# Altium schematic sheet Sheet1.SchDoc
size A
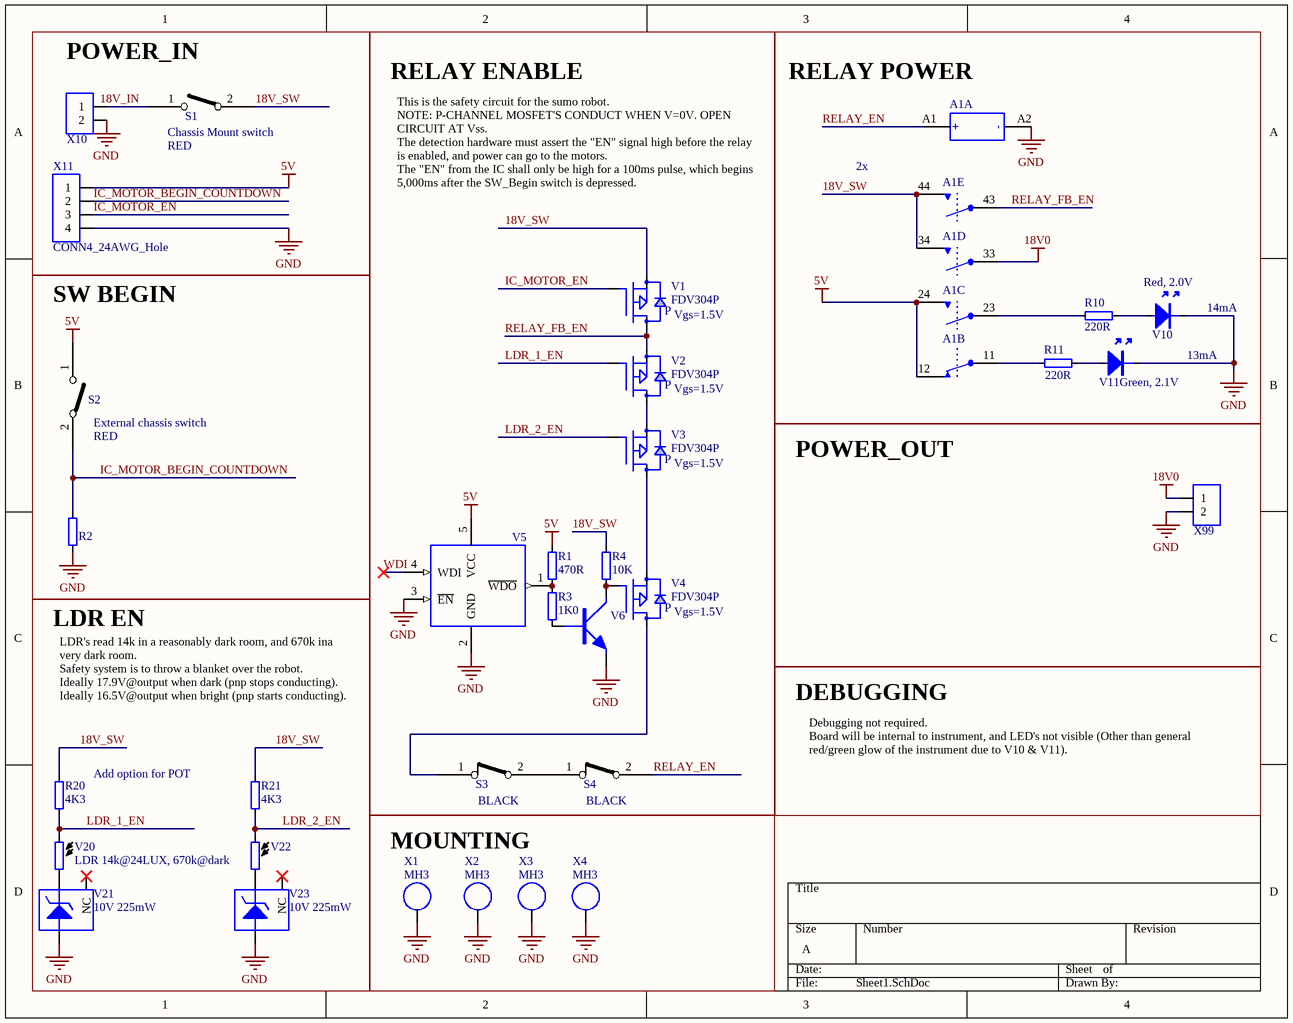
[diagram p0: Sheet1.SchDoc]

## Parts
A1  RELAY SAFETY 4PST 8A 18V  [RELAY-BRUMFIELD-4PST-3NO-1NC]  (value not drawn)  (parts A,B,C,D,E of 5)
R1  470R  [1206]
R2  10K  [1206]  (value not drawn)
R3  1K0  [1206]
R4  10K  [1206]
R10  220R  [1206]
R11  220R  [1206]
R20  4K3  [0603]
R21  4K3  [0603]
S1  SWITCH Rocker SPST Panel Mount, Red  [2_Wire_12AWG]  (value not drawn)
S2  Switch NO  [2_Wire_12AWG]  (value not drawn)
S3  Switch NC  [2_Wire_20AWG]  (value not drawn)
S4  Switch NC  [2_Wire_20AWG]  (value not drawn)
V1  FDV304P  [SOT23]
V2  FDV304P  [SOT23]
V3  FDV304P  [SOT23]
V4  FDV304P  [SOT23]
V5  STWD100NYWY3F  [SOT23-5]  (value not drawn)
V6  BC846B  [SOT23]  (value not drawn)
V10  Red, 2.0V  [LED-0805]
V11  Green, 2.1V  [LED-0805]
V20  LDR 14k@24LUX, 670k@dark  [LDR_NSL-5112]
V21  10V 225mW  [SOT23]
V22  LDR 14k@24LUX, 670k@dark  [LDR_NSL-5112]  (value not drawn)
V23  10V 225mW  [SOT23]
X1  MH3  [MH-M3-SEMS-6.7-3.6-Vias-Unplated]  (no BOM)
X2  MH3  [MH-M3-SEMS-6.7-3.6-Vias-Unplated]  (no BOM)
X3  MH3  [MH-M3-SEMS-6.7-3.6-Vias-Unplated]  (no BOM)
X4  MH3  [MH-M3-SEMS-6.7-3.6-Vias-Unplated]  (no BOM)
X10  CONN2_12AWG_Hole  [2_Wire_12AWG]  (value not drawn)  (no BOM)
X11  CONN4_24AWG_Hole  [4_Wire_0.1"]  (no BOM)
X99  CONN2_12AWG_Hole  [2_Wire_12AWG]  (value not drawn)  (no BOM)

## Blocks framed on the sheet
POWER_IN: S1 X10 X11
RELAY ENABLE: R1 R3 R4 S3 S4 V1-V6
RELAY POWER: A1 R10 R11 V10 V11
SW BEGIN: R2 S2
POWER_OUT: X99
LDR EN: R20 R21 V20-V23
MOUNTING: X1-X4

## Nets
5V: A1.12 A1.24 R1.1 S2.1 V5.5(VCC) X11.1
18V0: A1.33 X99.1
GND: A1.A2 R2.1 V5.2(GND) V5.3(~{EN}) V6.y(Emitter) V10.k V11.k V21.z(a) V23.z(a) X1.1 X2.1 X3.1 X4.1 X10.2 X11.4 X99.2
18V_SW: A1.34 A1.44 R4.2 R20.2 R21.2 S1.2 V1.y(s)
IC_MOTOR_BEGIN_COUNTDOWN: R2.2 S2.2 X11.2
IC_MOTOR_EN: V1.z(gate) X11.3
LDR_1_EN: R20.1 V2.z(gate) V20.1
LDR_2_EN: R21.1 V3.z(gate) V22.1
RELAY_EN: A1.A1 S4.2
RELAY_FB_EN: A1.43 V1.x(d) V2.y(s)
WDI: V5.4(WDI)
NetA1_11: A1.11 R11.1
NetA1_23: A1.23 R10.1
NetR1_2: R1.2 R3.2 V5.1(~{WDO})
NetR3_1: R3.1 V6.z(Base)
NetR4_1: R4.1 V4.z(gate) V6.x(Collector)
NetR10_2: R10.2 V10.a
NetR11_2: R11.2 V11.a
NetS1_1: S1.1 X10.1
NetS3_1: S3.1 V4.x(d)
NetS3_2: S3.2 S4.1
NetV2_x: V2.x(d) V3.y(s)
NetV3_x: V3.x(d) V4.y(s)
NetV20_2: V20.2 V21.x(k)
NetV22_2: V22.2 V23.x(k)

Not connected (* = marked no-connect by the designer): V21 y(NC)*; V23 y(NC)*

## Notes on the sheet
- (near S1) Chassis Mount switch
- (near S1) RED
- This is the safety circuit for the sumo robot.
  NOTE: P-CHANNEL MOSFET'S CONDUCT WHEN V=0V. OPEN CIRCUIT AT Vss.
  The detection hardware must assert the "EN" signal high before the relay is enabled, and power can go to the motors.
  The "EN" from the IC shall only be high for a 100ms pulse, which begins 5,000ms after the SW_Begin switch is depressed.
- 2x
- (near V1) Vgs=1.5V
- 13mA
- (near V10) 14mA
- (near S2) External chassis switch
- (near V2) Vgs=1.5V
- (near S2) RED
- (near V3) Vgs=1.5V
- (near V4) Vgs=1.5V
- DEBUGGING
- LDR's read 14k in a reasonably dark room, and 670k ina  very dark room.
  Safety system is to throw a blanket over the robot.
  Ideally 17.9V@output when dark (pnp stops conducting).
  Ideally 16.5V@output when bright (pnp starts conducting).
- Add option for POT
- (near S3) BLACK
- (near S4) BLACK
- Debugging not required.
  Board will be internal to instrument, and LED's not visible (Other than general red/green glow of the instrument due to V10 & V11).
- Labels drawn without touching a wire or pin: 18V_IN
- (in symbol 5221) P
- (in symbol 9827, part A) -; +

## Library data of the parts
A1 = 9827: Safety Relay 4PST, 3NO 1 NC; Manufacturer: TE Connectivity Potter & Brumfield Relays; PartNumber: SR4M4018; IPN: 9827; Characteristics: 18VDC 405ohm  1250VAC/8A-Switching-load; Lead_Process_Compatible: Yes; SubmittedBy: zmze; DeviceRank: 2; Part Field 1: RELAY SAFETY 4PST 8A 18V; Part Field 2: TE Connectivity Potter & Brumfield Relays SR4M4018; ComponentLink2Description: Compliant; Altium_Comment_Old: RELAY SAFETY 4PST 8A 18V; Altium_Comment: RELAY SAFETY 4PST 8A 18V; Symbol: RELAY-4PST-3A1B; LastChanged: 27/05/16 08:10:39; Supplier1: Digikey; Supplier1_PartNumber: PB1304-ND; IPN_Search: 9827; OrderNumber: SR4M4018; PartType: PCB; ComponentLink1Description: TE Connectivity Potter & Brumfield Relays_SR4M4018_ENG_DS_SR4_DXM_0415.pdf; ComponentLink1URL: http://ecad.vsl.com.au/apps/BomGen/Data/rel/datasheets/TE Connectivity Potter & Brumfield Relays/TE Connectivity Potter & Brumfield Relays_SR4M4018_ENG_DS_SR4_DXM_0415.pdf
R1 = 3835: Resistor; Part Field 1: RES 470R 1% 250mW 1206 RoHS; Manufacturer: Phycomp; PartNumber: RC1206FR-07470RL; IPN: 3835; EndOfLife: Active EOL:Jan 2023; Characteristics: 100ppm/C -55..+155C U=150Vrms Reel=5000pcs; OrderNumber: 232272464701L; Lead_Process_Compatible: Yes; SubmittedBy: ART; DeviceRank: 2; Part Field 2: Phycomp RC1206FR-07470RL; ComponentLink1Description: Phycomp_RC1206series_DS.pdf; ComponentLink2Description: Phycomp_Generic_RCS.pdf; ComponentLink1URL: http://ecad.vsl.com.au/apps/BomGen/Data/rel/datasheets/new_parts/Phycomp_RC1206series_DS.pdf; ComponentLink2URL: http://ecad.vsl.com.au/apps/BomGen/Data/rel/rohs_compliance/new_certificates/Phycomp_Generic_RCS.pdf; Altium_Comment_Old: RES 470R 1% 250mW 1206 RoHS; Altium_Comment: 470R; Symbol: RES; Supplier1: Arrow; Supplier1_PartNumber: RC1206FR-07470RL; Supplier2: Xon; IPN_Search: 3835; PartType: PCB; CheckedBy: ART; Price_5000: M$0.004
R2 R4 = 3867: Resistor; Part Field 1: RES 10K 1% 250mW 1206 RoHS; Manufacturer: Phycomp; PartNumber: RC1206FR-0710KL; IPN: 3867; EndOfLife: Active EOL:Jan 2031; Characteristics: 100ppm/C -55..+155C U=150Vrms Reel=5000pcs; OrderNumber: 232272461003L; Lead_Process_Compatible: Yes; SubmittedBy: ART; DeviceRank: 2; Part Field 2: Phycomp RC1206FR-0710KL; ComponentLink1Description: Phycomp_RC1206series_DS.pdf; ComponentLink2Description: Phycomp_Generic_RCS.pdf; ComponentLink1URL: http://ecad.vsl.com.au/apps/BomGen/Data/rel/datasheets/new_parts/Phycomp_RC1206series_DS.pdf; ComponentLink2URL: http://ecad.vsl.com.au/apps/BomGen/Data/rel/rohs_compliance/new_certificates/Phycomp_Generic_RCS.pdf; Altium_Comment_Old: RES 10K 1% 250mW 1206 RoHS; Altium_Comment: 10K; Symbol: RES; Supplier1: Arrow; Supplier1_PartNumber: RC1206FR-0710KL; Supplier2: Xon; IPN_Search: 3867; PartType: PCB; CheckedBy: ART; Price_5000: M$0.004
R3 = 3843: Resistor; Part Field 1: RES 1K0 1% 250mW 1206 RoHS; Manufacturer: Phycomp; PartNumber: RC1206FR-071KL; IPN: 3843; EndOfLife: Active EOL:Jan 2031; Characteristics: 100ppm/C -55..+155C U=150Vrms Reel=5000pcs; OrderNumber: 232272461002L; Lead_Process_Compatible: Yes; SubmittedBy: ART; DeviceRank: 2; Part Field 2: Phycomp RC1206FR-071KL; ComponentLink1Description: Phycomp_RC1206series_DS.pdf; ComponentLink2Description: Phycomp_Generic_RCS.pdf; ComponentLink1URL: http://ecad.vsl.com.au/apps/BomGen/Data/rel/datasheets/new_parts/Phycomp_RC1206series_DS.pdf; ComponentLink2URL: http://ecad.vsl.com.au/apps/BomGen/Data/rel/rohs_compliance/new_certificates/Phycomp_Generic_RCS.pdf; Altium_Comment_Old: RES 1K0 1% 250mW 1206 RoHS; Altium_Comment: 1K0; Symbol: RES; Supplier1: Arrow; Supplier1_PartNumber: RC1206FR-071KL; Supplier2: Xon; IPN_Search: 3843; PartType: PCB; CheckedBy: ART; Price_5000: M$0.004
R10 R11 = 3827: Resistor; Part Field 1: RES 220R 1% 250mW 1206 RoHS; Manufacturer: Phycomp; PartNumber: RC1206FR-07220RL; IPN: 3827; EndOfLife: Active EOL:Jan 2023; Characteristics: 100ppm/C -55..+155C U=150Vrms Reel=5000pcs; OrderNumber: 232272462201L; Lead_Process_Compatible: Yes; SubmittedBy: ART; DeviceRank: 2; Part Field 2: Phycomp RC1206FR-07220RL; ComponentLink1Description: Phycomp_RC1206series_DS.pdf; ComponentLink2Description: Phycomp_Generic_RCS.pdf; ComponentLink1URL: http://ecad.vsl.com.au/apps/BomGen/Data/rel/datasheets/new_parts/Phycomp_RC1206series_DS.pdf; ComponentLink2URL: http://ecad.vsl.com.au/apps/BomGen/Data/rel/rohs_compliance/new_certificates/Phycomp_Generic_RCS.pdf; Altium_Comment_Old: RES 220R 1% 250mW 1206 RoHS; Altium_Comment: 220R; Symbol: RES; Supplier1: Arrow; Supplier1_PartNumber: RC1206FR-07220RL; Supplier2: Xon; IPN_Search: 3827; PartType: PCB; CheckedBy: ART; Price_5000: M$0.004
R20 R21 = 3520: Resistor; Part Field 1: RES 4K3 1% 100mW 0603 RoHS; Manufacturer: Phycomp; PartNumber: RC0603FR-074K3L; IPN: 3520; EndOfLife: Active EOL:Jan 2023; AltIPN1: 6663; AltMFG1: PANASONIC; AltPN1: ERJ3EKF4301V; Characteristics: 100ppm/C -55..+155C U=50Vrms Reel=5000pcs; OrderNumber: 232270464302L; Lead_Process_Compatible: Yes; SubmittedBy: ART; DeviceRank: 1; Part Field 2: Phycomp RC0603FR-074K3L; ComponentLink1Description: Phycomp_RC0603series_DS.pdf; ComponentLink2Description: Phycomp_Generic_RCS.pdf; ComponentLink1URL: http://ecad.vsl.com.au/apps/BomGen/Data/rel/datasheets/new_parts/Phycomp_RC0603series_DS.pdf; ComponentLink2URL: http://ecad.vsl.com.au/apps/BomGen/Data/rel/rohs_compliance/new_certificates/Phycomp_Generic_RCS.pdf; Altium_Comment_Old: RES 4K3 1% 100mW 0603 RoHS; Altium_Comment: 4K3; Symbol: RES; LastChanged: 28/11/07 14:44:00; AltDesc1: RES 4K3 1% 100mW 0603 RoHS; AltROHS1: pa003.pdf; AltEOL1: Active EOL:Jan 2023; Supplier1: Arrow; Supplier1_PartNumber: RC0603FR-074K3L; Supplier2: Xon; Supplier2_PartNumber: 232270464302L; IPN_Search: 3520; PartType: PCB; CheckedBy: ART; Price_5000: M$0.002
S1 = 9815: SWITCH; Manufacturer: Cherry; PartNumber: CRE22F2BBRLE; IPN: 9815; Characteristics: V=125Vac, I=20A; Lead_Process_Compatible: Yes; SubmittedBy: presi; DeviceRank: 2; Part Field 1: SWITCH Rocker SPST Panel Mount, Red; Part Field 2: Cherry CRE22F2BBRLE; ComponentLink1Description: -; ComponentLink2Description: Compliant; ComponentLink1URL: -; ComponentLink2URL: -; Altium_Comment_Old: SWITCH Rocker SPST Panel Mount, Red; Altium_Comment: SWITCH Rocker SPST Panel Mount, Red; Symbol: Switch_SPST-NO; LastChanged: 13-06-16 21:14:44; Supplier1: DigiKey; Supplier1_PartNumber: CH809-ND; IPN_Search: 9815; OrderNumber: CRE22F2BBRLE; PartType: PCB
S2 = 9814: SWITCH; Part Field 1: Switch, Panel Mount, Momentary, SPST-NO, 0.5A 125V, RoHS; Manufacturer: TE Connectivity; PartNumber: 1437568-6; IPN: 9814; Characteristics: 0.5A 125V; Lead_Process_Compatible: Yes; SubmittedBy: presi; DeviceRank: 2; Part Field 2: TE Connectivity 1437568-6; ComponentLink1Description: -; ComponentLink2Description: Compliant; ComponentLink1URL: -; ComponentLink2URL: -; Altium_Comment_Old: Switch, Panel Mount, Momentary, SPST-NO, 0.5A 125V, RoHS; Altium_Comment: Switch NO; Symbol: Switch_SPST-NO; LastChanged: 13-06-16 21:00:15; Supplier1: Digi-Key; Supplier1_PartNumber: 450-1110-ND; IPN_Search: 9814; OrderNumber: 1437568-6; PartType: PCB
S3 S4 = 9813: SWITCH; Part Field 1: Switch, Panel Mount, Momentary, SPST-NC, 0.5A 125V, RoHS; Manufacturer: TE Connectivity; PartNumber: MSPS103B; IPN: 9813; Characteristics: 0.5A 125V; Lead_Process_Compatible: Yes; SubmittedBy: presi; DeviceRank: 2; Part Field 2: TE Connectivity MSPS103B; ComponentLink1Description: -; ComponentLink2Description: Compliant; ComponentLink1URL: -; ComponentLink2URL: -; Altium_Comment_Old: Switch, Panel Mount, Momentary, SPST-NC, 0.5A 125V, RoHS; Altium_Comment: Switch NC; Symbol: Switch_SPST-NC; LastChanged: 13-06-16 20:48:49; Supplier1: Digi-Key; Supplier1_PartNumber: 450-1099-ND; IPN_Search: 9813; OrderNumber: MSPS103B; PartType: PCB
V1-V4 = 5221: MOSFET P CHANNEL GENERIC SOT23; Part Field 1: MOSFET P-CH FDV304P SOT23; Manufacturer: Fairchild; IPN: 5221; EndOfLife: Active EOL:Jul 2022; Characteristics: 25V 0.46A 1.5R Vgs=1.5V 150deg; Lead_Process_Compatible: Yes; SubmittedBy: KZB; DeviceRank: 2; Part Field 2: Fairchild FDV304P; ComponentLink1Description: Fairchild_FDV304P_DS.pdf; ComponentLink2Description: Fairchild_Generic_RCS.pdf; ComponentLink1URL: http://ecad.vsl.com.au/apps/BomGen/Data/rel/datasheets/new_parts/Fairchild_FDV304P_DS.pdf; ComponentLink2URL: http://ecad.vsl.com.au/apps/BomGen/Data/rel/rohs_compliance/new_certificates/Fairchild_Generic_RCS.pdf; Altium_Comment_Old: MOSFET P-CH FDV304P SOT23; Altium_Comment: FDV304P; Symbol: MOSFET-P-SOT23; PartNumber: FDV304P; LastChanged: 10/06/10 13:58:43; Supplier1: Digikey; Supplier1_PartNumber: FDV304PCT-ND; Supplier2: Farnell; Supplier2_PartNumber: 9846123; IPN_Search: 5221; OrderNumber: FDV304P; PartType: PCB; Price: 0.697; CheckedBy: AJR; Price_100: M$0.102; Price_1000: M$0.070; Price_5000: M$0.053
V5 = 5674: IC Watchdog Timer Circuit; Part Field 1: Microprocessor Watchdog Timer STWD100NY; Manufacturer: ST Microelectronics; IPN: 5674; EndOfLife: Active EOL:Dec 2024; Characteristics: Open Drain Output 210ms; Lead_Process_Compatible: Yes; SubmittedBy: GRH; DeviceRank: 2; Part Field 2: ST Microelectronics STWD100NYWY3F; ComponentLink1Description: STWD100.pdf; ComponentLink2Description: ROHSSTWD100NYWY3F.pdf; ComponentLink1URL: http://ecad.vsl.com.au/apps/BomGen/Data/rel/datasheets/new_parts/STWD100.pdf; ComponentLink2URL: http://ecad.vsl.com.au/apps/BomGen/Data/rel/rohs_compliance/new_certificates/ROHSSTWD100NYWY3F.pdf; Altium_Comment_Old: Microprocessor Watchdog Timer STWD100NY; Altium_Comment: STWD100NYWY3F; Symbol: STWD100; PartNumber: STWD100NYWY3F; LastChanged: 20/04/11 08:20:11; Supplier1: Digikey; Supplier1_PartNumber: 497-10058-1-ND; IPN_Search: 5674; PartType: PCB; Price: 1.40 (USD); CheckedBy: SAA; Price_100: M$0.611; Price_1000: M$0.426; Price_5000: M$0.378
V6 = 3412: NPN Transistor SOT23; Part Field 1: BJT NPN BC846 SOT23 RoHS; Manufacturer: NXP; IPN: 3412; EndOfLife: Active EOL:Nov 2023; Characteristics: Ic=100mA Vceo=65V Pt=250mW Tj=150degC Hfe=200..450; OrderNumber: 9335 895 60215; Lead_Process_Compatible: Yes; SubmittedBy: ART; DeviceRank: 1; Part Field 2: NXP BC846B; ComponentLink1Description: NXP_BC84xseries_DS.pdf; ComponentLink2Description: NXP_BC846B_MD.xls; ComponentLink1URL: http://ecad.vsl.com.au/apps/BomGen/Data/rel/datasheets/new_parts/NXP_BC84xseries_DS.pdf; ComponentLink2URL: Not Found; Altium_Comment_Old: BJT NPN BC846 SOT23 RoHS; Altium_Comment: BC846B; Symbol: NPN-SOT23; PartNumber: BC846B; LastChanged: 24/08/09 11:56:43; Supplier1: Mouser; Supplier1_PartNumber: 771-BC846B-T/R; Supplier2: Digikey; Supplier2_PartNumber: 568-1632-1-ND; IPN_Search: 3412; PartType: PCB; CheckedBy: LZZ; Price_100: M$0.040; Price_1000: M$0.027; Price_5000: M$0.020
V10 = 2785: LED; Part Field 1: LED Red 12mcd@20mA 0805 RoHS; Manufacturer: Kingbright; PartNumber: KP-2012EC; IPN: 2785; EndOfLife: Active EOL:Jun 2020; Characteristics: Wpk=627nm Vftyp=2V Vfmax=2.5V Ifmax=30mA -40..+85 View angle=120deg; Lead_Process_Compatible: Yes; SubmittedBy: LGG; DeviceRank: 2; Part Field 2: Kingbright KP-2012EC; ComponentLink1Description: Kingbright_KP-2012EC_DS.pdf; ComponentLink2Description: Kingbright_KPseries_RCS.pdf; ComponentLink1URL: http://ecad.vsl.com.au/apps/BomGen/Data/rel/datasheets/new_parts/Kingbright_KP-2012EC_DS.pdf; ComponentLink2URL: http://ecad.vsl.com.au/apps/BomGen/Data/rel/rohs_compliance/new_certificates/Kingbright_KPseries_RCS.pdf; Altium_Comment_Old: LED Red 12mcd@20mA 0805 RoHS; Altium_Comment: LED Red 12mcd@20mA 0805 RoHS; Symbol: LED; LastChanged: 27/06/08 15:06:33; Supplier1: Tenrod; Supplier1_PartNumber: KP-2012EC; Supplier2: Farnell; Supplier2_PartNumber: 8529949; IPN_Search: 2785; OrderNumber: KP-2012EC; PartType: PCB; Price: 0.08; CheckedBy: ART
V11 = 6313: LED; Part Field 1: LED GREEN 0805 ROHS; Manufacturer: Chicago Miniature Lighting; PartNumber: CMD17-21UGC/TR8; IPN: 6313; EndOfLife: Active EOL:Sep 2021; Characteristics: GREEN Intensity=15mcd Ta=-40..+85C; Lead_Process_Compatible: Yes; SubmittedBy: ZJXL; DeviceRank: 2; Part Field 2: Chicago Miniature Lighting CMD17-21UGC/TR8; ComponentLink1Description: 1-25.pdf; ComponentLink2Description: CMD17-21UGC_TR8 RoHS CoC.pdf; ComponentLink1URL: \\michelangelo\erg shared folder\ECAD\elecCAD\apps\BomGen\Data\rel\datasheets\new_parts\1-25.pdf; ComponentLink2URL: \\michelangelo\erg shared folder\ECAD\elecCAD\apps\BomGen\Data\rel\rohs_compliance\new_certificates\CMD17-21UGC_TR8 RoHS CoC.pdf; Altium_Comment_Old: LED GREEN 0805 ROHS; Altium_Comment: LED Green; Symbol: LED; LastChanged: 6/09/13 17:30:23; Supplier1: Mouser; Supplier1_PartNumber: 606-CMD17-21UGC; Supplier2: DIGIKEY; Supplier2_PartNumber: L62415CT-ND; IPN_Search: 6313; OrderNumber: CMD17-21UGC/TR8; PartType: PCB; Price: 0.279 USD; CheckedBy: SAA; Price_100: M$0.170; Price_1000: M$0.150; Price_5000: M$0.150
V20 V22 = 9828: LDR; Part Field 1: LDR Photocell, 14k@24LUX, 670k@dark; Manufacturer: Luna Optoelectronics; IPN: 9828; Characteristics: 550nm, 100vPk, -65...+75C, 50mW max,; Lead_Process_Compatible: Yes; SubmittedBy: zmze; DeviceRank: 2; Part Field 2: Luna Optoelectronics NSL-5112; ComponentLink1Description: Luna Optoelectronics_NSL-5112_NSL-5112.pdf; ComponentLink2Description: Non_compliant; ComponentLink1URL: http://ecad.vsl.com.au/apps/BomGen/Data/rel/datasheets/Luna Optoelectronics/Luna Optoelectronics_NSL-5112_NSL-5112.pdf; Altium_Comment_Old: LDR Photocell, 14k@24LUX, 670k@dark; Altium_Comment: LDR 14k@24LUX, 670k@dark; Symbol: LDR; PartNumber: NSL-5112; LastChanged: 27/05/16 08:14:08; Supplier1: Digikey; Supplier1_PartNumber: NSL-5112-ND; IPN_Search: 9828; OrderNumber: NSL-5112; PartType: PCB
V21 V23 = 6327: DIODE ZENER SOT23 a-z k-x nc-y; Part Field 1: DIODE ZENER 10V 5% 225mW SOT23 RoHS; Manufacturer: ON Semi; PartNumber: BZX84C10LT1G; IPN: 6327; Characteristics: Vf=900mV Zzt=20R -65..+150C Reel=3000; Lead_Process_Compatible: Yes; SubmittedBy: VQD; DeviceRank: 2; Part Field 2: ON Semi BZX84C10LT1G; ComponentLink1Description: ON Semi_BZX84C10LT1G_BZX84 Series.pdf; ComponentLink2Description: ON Semi_BZX84C10LT1G_BZX84C10LT1G RoHS Cert.pdf; ComponentLink1URL: http://ecad.vsl.com.au/apps/BomGen/Data/rel/datasheets/ON Semi/ON Semi_BZX84C10LT1G_BZX84 Series.pdf; ComponentLink2URL: http://ecad.vsl.com.au/apps/BomGen/Data/rel/rohs_compliance/new_certificates/ON Semi_BZX84C10LT1G_BZX84C10LT1G RoHS Cert.pdf; Altium_Comment_Old: DIODE ZENER 10V 5% 225mW SOT23 RoHS; Altium_Comment: 10V 225mW; Symbol: ZENER-SOT23; LastChanged: 07/07/14 15:36:02; Supplier1: Digikey; Supplier1_PartNumber: BZX84C10LT1GOSTR-ND; IPN_Search: 6327; OrderNumber: BZX84C10LT1G; PartType: PCB; Price: 0.08990
X1-X4 = 7545: MOUNTING HOLE; Part Field 1: MH3 Loose Unplated with Vias; IPN: 7545; Lead_Process_Compatible: Yes; SubmittedBy: zad; DeviceRank: 2; Part Field 2: - -; ComponentLink1Description: -; ComponentLink2Description: Compliant; ComponentLink1URL: -; ComponentLink2URL: -; Altium_Comment_Old: MH3 Loose Unplated with Vias; Altium_Comment: MH3; Symbol: MOUNTING-HOLE; Manufacturer: -; PartNumber: -; LastChanged: 24/06/14 18:13:23; IPN_Search: 7545; OrderNumber: -; PartType: PCB; CheckedBy: vhq
X10 X99 = -: Symbol: CONN2; Lead_Process_Compatible: Yes; SubmittedBy: ZMZE; DeviceRank: 2; IPN: -; Part Field 1: CONN2_12AWG_Hole; Part Field 2: -; Altium_Comment_Old: CONN2_12AWG_Hole; Altium_Comment: CONN2_12AWG_Hole; Manufacturer: -; PartNumber: -; LastChanged: 27/09/12 10:20:42; Supplier1: -; Supplier1_PartNumber: -; Supplier2: -; Supplier2_PartNumber: -; IPN_Search: -; Characteristics: -; OrderNumber: -; PartType: PCB; Price: -; CheckedBy: -; Price_100: -; Price_1000: -; Price_5000: -
X11 = CONN4: Altium_Comment: CONN4_24AWG_Hole